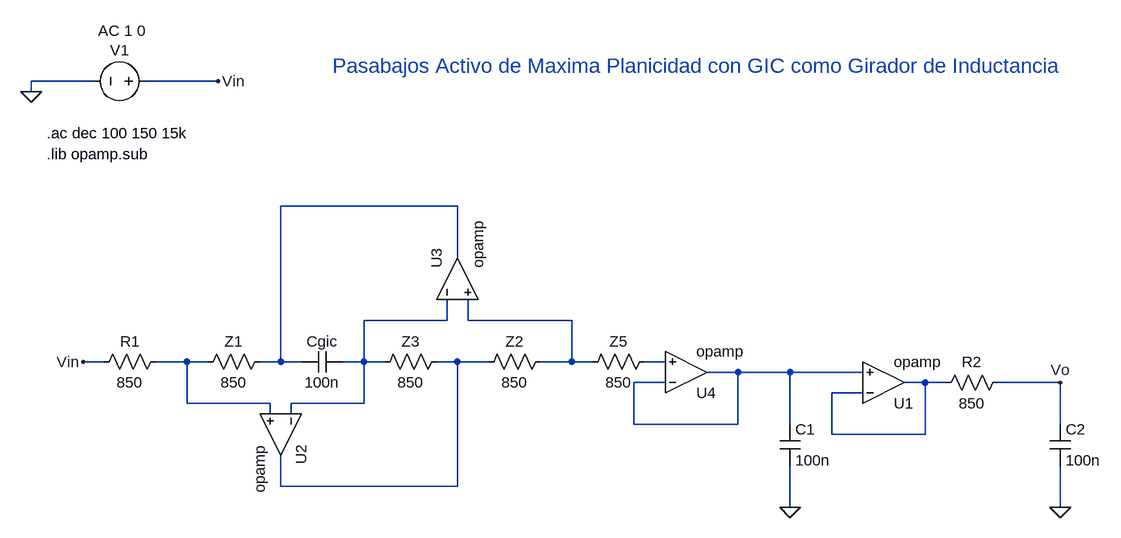
[diagram p0: schematic Circuito_GIC.asc]
Circuito_GIC.asc, the LTspice schematic file:
Version 4
SHEET 1 1356 680
WIRE -1040 -336 -1136 -336
WIRE -848 -336 -960 -336
WIRE -1136 -320 -1136 -336
WIRE -480 -144 -752 -144
WIRE -480 -64 -480 -144
WIRE -496 32 -496 0
WIRE -496 32 -624 32
WIRE -464 32 -464 0
WIRE -304 32 -464 32
WIRE -1024 96 -1056 96
WIRE -896 96 -944 96
WIRE -864 96 -896 96
WIRE -752 96 -752 -144
WIRE -752 96 -784 96
WIRE -720 96 -752 96
WIRE -624 96 -624 32
WIRE -624 96 -656 96
WIRE -592 96 -624 96
WIRE -480 96 -512 96
WIRE -432 96 -480 96
WIRE -304 96 -304 32
WIRE -304 96 -352 96
WIRE -272 96 -304 96
WIRE -160 96 -192 96
WIRE -48 112 -96 112
WIRE 32 112 -48 112
WIRE 144 112 32 112
WIRE -160 128 -208 128
WIRE 240 128 208 128
WIRE 272 128 240 128
WIRE 448 128 352 128
WIRE 144 144 96 144
WIRE -896 160 -896 96
WIRE -768 160 -896 160
WIRE -624 160 -624 96
WIRE -624 160 -736 160
WIRE -768 176 -768 160
WIRE -736 176 -736 160
WIRE -208 192 -208 128
WIRE -48 192 -48 112
WIRE -48 192 -208 192
WIRE 32 192 32 112
WIRE 448 192 448 128
WIRE 96 208 96 144
WIRE 240 208 240 128
WIRE 240 208 96 208
WIRE -752 288 -752 240
WIRE -480 288 -480 96
WIRE -480 288 -752 288
WIRE 32 320 32 256
WIRE 448 320 448 256
FLAG 448 320 0
FLAG -1056 96 Vin
FLAG 448 128 Vo
FLAG -1136 -320 0
FLAG -848 -336 Vin
FLAG 32 320 0
SYMBOL OpAmps\\opamp 176 192 M180
SYMATTR InstName U1
SYMBOL res -928 80 R90
WINDOW 0 0 56 VBottom 2
WINDOW 3 32 56 VTop 2
SYMATTR InstName R1
SYMATTR Value 850
SYMBOL res 368 112 R90
WINDOW 0 0 56 VBottom 2
WINDOW 3 32 56 VTop 2
SYMATTR InstName R2
SYMATTR Value 850
SYMBOL cap 16 192 R0
SYMATTR InstName C1
SYMATTR Value 100n
SYMBOL cap 432 192 R0
SYMATTR InstName C2
SYMATTR Value 100n
SYMBOL voltage -944 -336 R90
WINDOW 0 -32 56 VBottom 2
WINDOW 3 32 56 VTop 2
WINDOW 123 -62 52 VBottom 2
WINDOW 39 0 0 Left 0
SYMATTR InstName V1
SYMATTR Value ""
SYMATTR Value2 AC 1 0
SYMBOL OpAmps\\opamp -688 208 R90
SYMATTR InstName U2
SYMBOL res -176 80 R90
WINDOW 0 0 56 VBottom 2
WINDOW 3 32 56 VTop 2
SYMATTR InstName Z5
SYMATTR Value 850
SYMBOL res -448 112 R270
WINDOW 0 32 56 VTop 2
WINDOW 3 0 56 VBottom 2
SYMATTR InstName Z2
SYMATTR Value 850
SYMBOL res -608 112 R270
WINDOW 0 32 56 VTop 2
WINDOW 3 0 56 VBottom 2
SYMATTR InstName Z3
SYMATTR Value 850
SYMBOL res -768 80 R90
WINDOW 0 0 56 VBottom 2
WINDOW 3 32 56 VTop 2
SYMATTR InstName Z1
SYMATTR Value 850
SYMBOL cap -656 80 R90
WINDOW 0 0 32 VBottom 2
WINDOW 3 32 32 VTop 2
SYMATTR InstName Cgic
SYMATTR Value 100n
SYMBOL OpAmps\\opamp -544 -32 R270
SYMATTR InstName U3
SYMBOL OpAmps\\opamp -128 176 M180
SYMATTR InstName U4
TEXT -1112 -224 Left 2 !.lib opamp.sub
TEXT -1112 -256 Left 2 !.ac dec 100 150 15k
TEXT -672 -360 Left 3 ;Pasabajos Activo de Maxima Planicidad con GIC como Girador de Inductancia

The netlist it stands for:
* Circuito_GIC.asc
XU1 N008 N007 N008 opamp Aol=100K GBW=10Meg  ; pins invin noninvin out
R1 N004 Vin 850
R2 Vo N008 850
C1 N007 0 100n
C2 Vo 0 100n
V1 Vin 0 AC 1 0
XU2 N002 N004 N005 opamp Aol=100K GBW=10Meg  ; pins invin noninvin out
R§Z5 N006 N003 850
R§Z2 N005 N003 850
R§Z3 N002 N005 850
R§Z1 N001 N004 850
Cgic N002 N001 100n
XU3 N002 N003 N001 opamp Aol=100K GBW=10Meg  ; pins invin noninvin out
XU4 N007 N006 N007 opamp Aol=100K GBW=10Meg  ; pins invin noninvin out
.lib opamp.sub
.ac dec 100 150 15k
* Pasabajos Activo de Maxima Planicidad con GIC como Girador de Inductancia
.backanno
.end

* Results of the author's LTspice run, read from the files saved beside the schematic
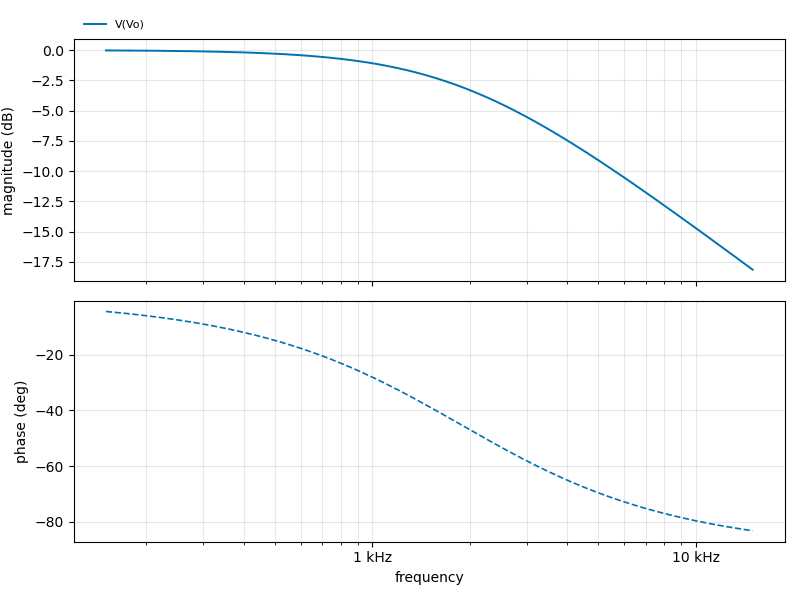
[diagram p1: AC Analysis of Circuito_GIC.asc, plotted from the saved traces]
* AC Analysis, 1 run:
*   V(Vo): -0.03 dB at 150 Hz, -18.14 dB at 15 kHz, peak -0.03 dB at 150 Hz, 3 dB below the peak at 1.884 kHz